# EAGLE design p1s-001 (EAGLE 9.6.2)
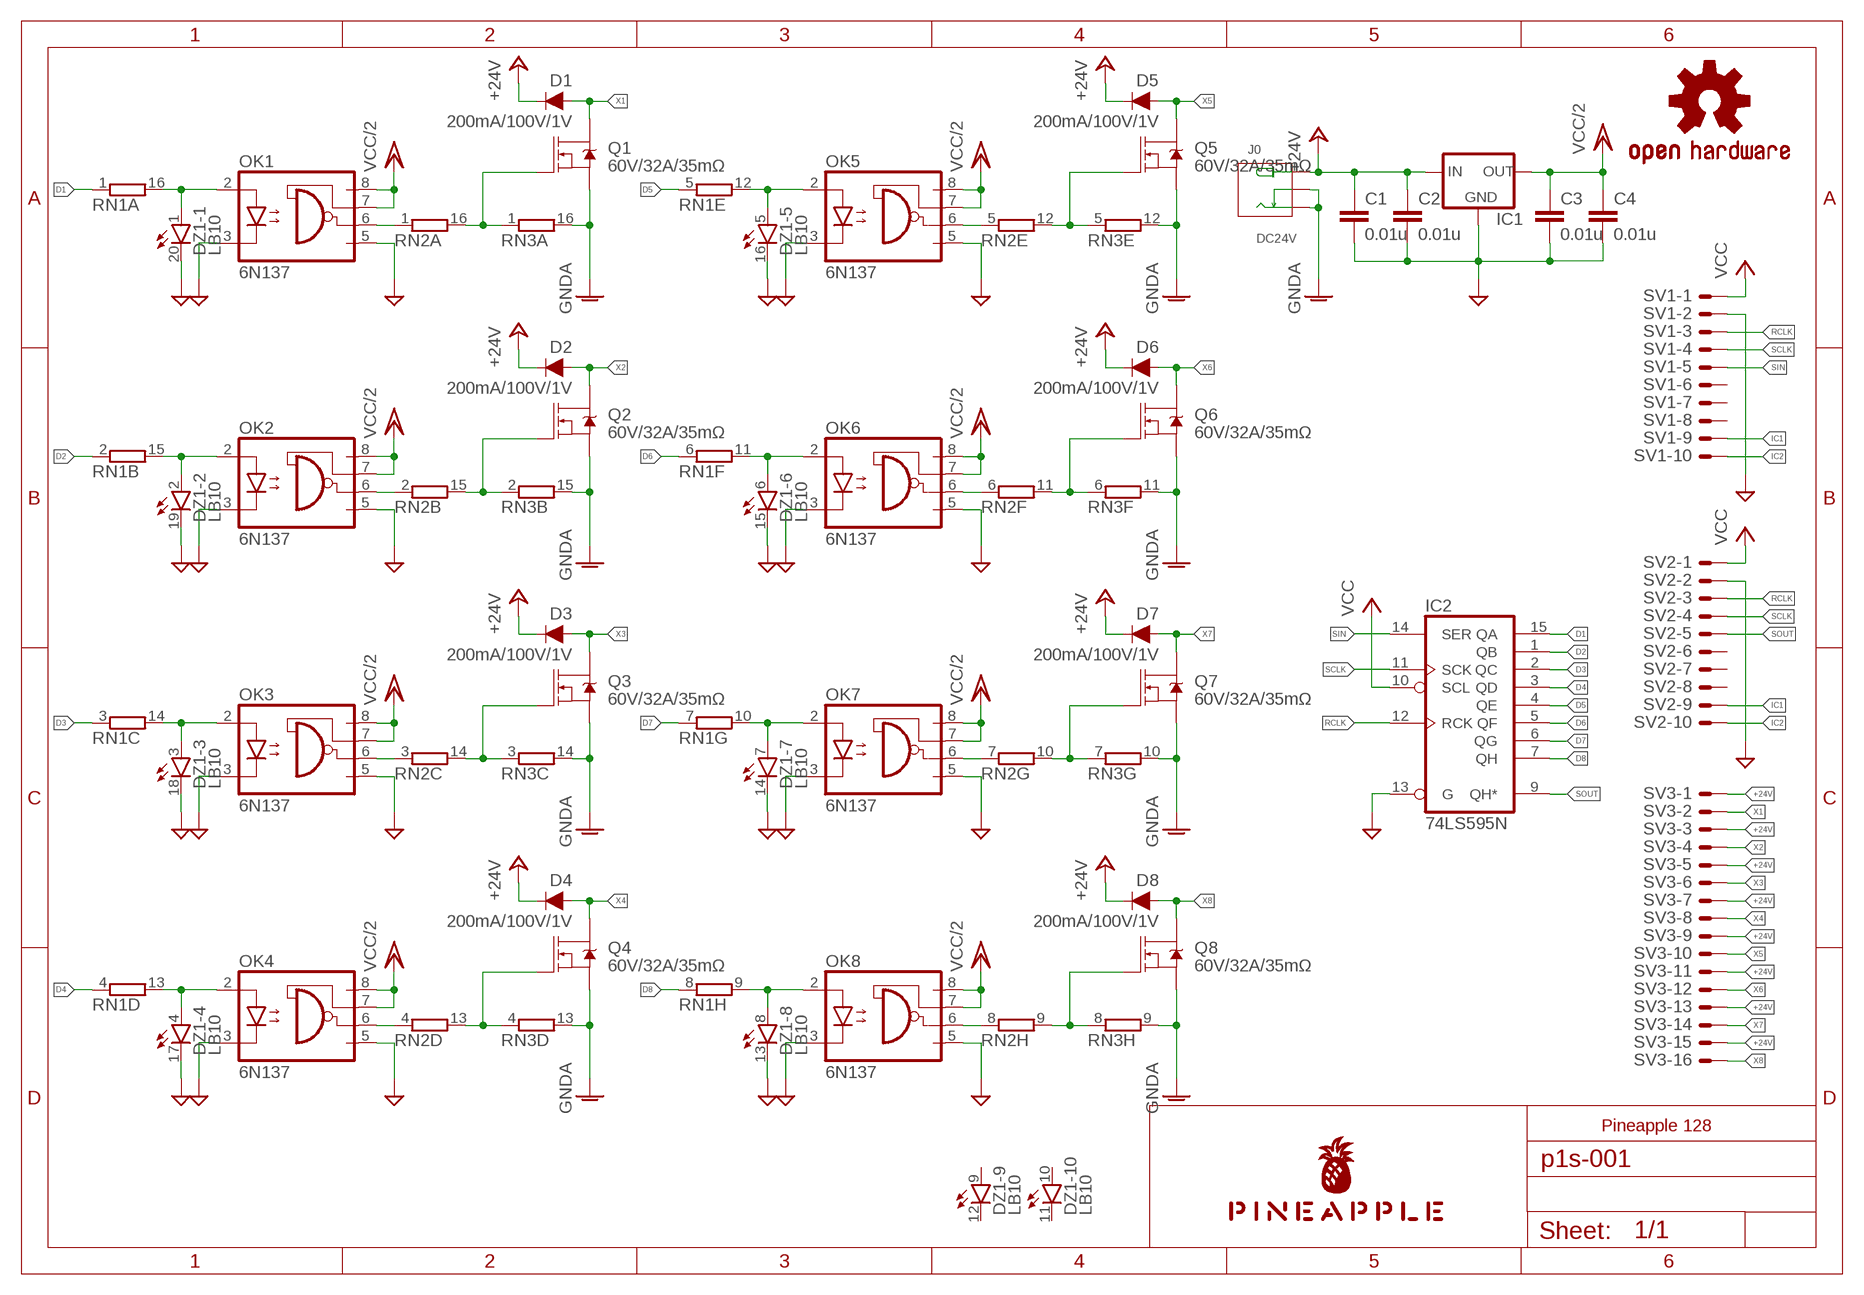
[diagram p0: schematic, sheet 1]

## Parts
C1  0.01u  C-EU025-024X044  [C025-024X044]
C2  0.01u  C-EU025-024X044  [C025-024X044]
C3  0.01u  C-EU025-024X044  [C025-024X044]
C4  0.01u  C-EU025-024X044  [C025-024X044]
D1  200mA/100V/1V  DIODE-1N4148  [DIODE-1N4148]
D2  200mA/100V/1V  DIODE-1N4148  [DIODE-1N4148]
D3  200mA/100V/1V  DIODE-1N4148  [DIODE-1N4148]
D4  200mA/100V/1V  DIODE-1N4148  [DIODE-1N4148]
D5  200mA/100V/1V  DIODE-1N4148  [DIODE-1N4148]
D6  200mA/100V/1V  DIODE-1N4148  [DIODE-1N4148]
D7  200mA/100V/1V  DIODE-1N4148  [DIODE-1N4148]
D8  200mA/100V/1V  DIODE-1N4148  [DIODE-1N4148]
DZ1  LB10  [LB10]
IC1  78XXS  [78XXS]
IC2  74LS595N  [DIL16]
J0  DC24V  JACK-DC-005'DC-005'  [3P-L14.2*W11.0*H9.0MM]
LOGO1  OSHW-LOGOS-COPPER  [OSHW-LOGO-S_COPPER]
OK1  6N137  [DIL08]
OK2  6N137  [DIL08]
OK3  6N137  [DIL08]
OK4  6N137  [DIL08]
OK5  6N137  [DIL08]
OK6  6N137  [DIL08]
OK7  6N137  [DIL08]
OK8  6N137  [DIL08]
Q1  60V/32A/35mΩ  MOSFET-NCH-FQP30N06L  [TO220V]
Q2  60V/32A/35mΩ  MOSFET-NCH-FQP30N06L  [TO220V]
Q3  60V/32A/35mΩ  MOSFET-NCH-FQP30N06L  [TO220V]
Q4  60V/32A/35mΩ  MOSFET-NCH-FQP30N06L  [TO220V]
Q5  60V/32A/35mΩ  MOSFET-NCH-FQP30N06L  [TO220V]
Q6  60V/32A/35mΩ  MOSFET-NCH-FQP30N06L  [TO220V]
Q7  60V/32A/35mΩ  MOSFET-NCH-FQP30N06L  [TO220V]
Q8  60V/32A/35mΩ  MOSFET-NCH-FQP30N06L  [TO220V]
RN1  8R-N  [DIL16]
RN2  8R-N  [DIL16]
RN3  8R-N  [DIL16]
SV1  ML10LE  [ML10L]
SV2  ML10LE  [ML10L]
SV3  ML16LE  [ML16L]
U$1  PINEAPPLE450_SILK  [PINEAPPLE450_SILK]

## Nets
+24V [power]: C1.1 C2.1 D1.C D2.C D3.C D4.C D5.C D6.C D7.C D8.C IC1.IN J0.+ SV3.1 SV3.3 SV3.5 SV3.7 SV3.9 SV3.11 SV3.13 SV3.15
D1: IC2.15(QA) RN1.1
D2: IC2.1(QB) RN1.2
D3: IC2.2(QC) RN1.3
D4: IC2.3(QD) RN1.4
D5: IC2.4(QE) RN1.5
D6: IC2.5(QF) RN1.6
D7: IC2.6(QG) RN1.7
D8: IC2.7(QH) RN1.8
GND [gnd]: C1.2 C2.2 C3.2 C4.2 DZ1.13(-8:C) DZ1.14(-7:C) DZ1.15(-6:C) DZ1.16(-5:C) DZ1.17(-4:C) DZ1.18(-3:C) DZ1.19(-2:C) DZ1.20(-1:C) IC1.GND IC2.13(G) OK1.3(C) OK1.5(GND) OK2.3(C) OK2.5(GND) OK3.3(C) OK3.5(GND) OK4.3(C) OK4.5(GND) OK5.3(C) OK5.5(GND) OK6.3(C) OK6.5(GND) OK7.3(C) OK7.5(GND) OK8.3(C) OK8.5(GND) SV1.2 SV2.2
GNDA [gnd]: J0.-1(-) J0.-2(CDN) Q1.3(S) Q2.3(S) Q3.3(S) Q4.3(S) Q5.3(S) Q6.3(S) Q7.3(S) Q8.3(S) RN3.9 RN3.10 RN3.11 RN3.12 RN3.13 RN3.14 RN3.15 RN3.16
IC1: SV1.9 SV2.9
IC2: SV1.10 SV2.10
N$1: DZ1.1(-1:A) OK1.2(A) RN1.16
N$2: OK1.6(VO) RN2.1
N$3: Q1.1(G) RN2.16 RN3.1
N$4: DZ1.2(-2:A) OK2.2(A) RN1.15
N$5: OK2.6(VO) RN2.2
N$6: Q2.1(G) RN2.15 RN3.2
N$7: DZ1.3(-3:A) OK3.2(A) RN1.14
N$8: OK3.6(VO) RN2.3
N$9: Q3.1(G) RN2.14 RN3.3
N$10: DZ1.4(-4:A) OK4.2(A) RN1.13
N$11: OK4.6(VO) RN2.4
N$12: Q4.1(G) RN2.13 RN3.4
N$13: DZ1.5(-5:A) OK5.2(A) RN1.12
N$14: OK5.6(VO) RN2.5
N$15: Q5.1(G) RN2.12 RN3.5
N$16: DZ1.6(-6:A) OK6.2(A) RN1.11
N$17: OK6.6(VO) RN2.6
N$18: Q6.1(G) RN2.11 RN3.6
N$19: DZ1.7(-7:A) OK7.2(A) RN1.10
N$20: OK7.6(VO) RN2.7
N$21: Q7.1(G) RN2.10 RN3.7
N$22: DZ1.8(-8:A) OK8.2(A) RN1.9
N$23: OK8.6(VO) RN2.8
N$24: Q8.1(G) RN2.9 RN3.8
RCLK: IC2.12(RCK) SV1.3 SV2.3
SCLK: IC2.11(SCK) SV1.4 SV2.4
SIN: IC2.14(SER) SV1.5
SOUT: IC2.9(QH*) SV2.5
VCC: IC2.10(SCL) SV1.1 SV2.1
VCC/2 [power]: C3.1 C4.1 IC1.OUT OK1.7(VE) OK1.8(VCC) OK2.7(VE) OK2.8(VCC) OK3.7(VE) OK3.8(VCC) OK4.7(VE) OK4.8(VCC) OK5.7(VE) OK5.8(VCC) OK6.7(VE) OK6.8(VCC) OK7.7(VE) OK7.8(VCC) OK8.7(VE) OK8.8(VCC)
X1: D1.A Q1.2(D) SV3.2
X2: D2.A Q2.2(D) SV3.4
X3: D3.A Q3.2(D) SV3.6
X4: D4.A Q4.2(D) SV3.8
X5: D5.A Q5.2(D) SV3.10
X6: D6.A Q6.2(D) SV3.12
X7: D7.A Q7.2(D) SV3.14
X8: D8.A Q8.2(D) SV3.16
Unconnected: DZ1.9(-9:A) DZ1.10(-10:A) DZ1.11(-10:C) DZ1.12(-9:C) SV1.6 SV1.7 SV1.8 SV2.6 SV2.7 SV2.8

## Notes on the sheet
- Pineapple 128

## Power pins joined to a net without a drawn wire
GND: IC2.8(GND)
VCC: IC2.16(VCC)

## Library data of the parts
C1-C4 = resistor:C-EU: CAPACITOR, European symbol
D1-D8 = SparkFun-DiscreteSemi:DIODE: Diode These are standard reverse protection diodes and small signal diodes. SparkFun Products: SparkFun SparkPunk Sound Kit <https://www.sparkfun.com/products/11177> SparkFun ESP8266 Thing <https://www.sparkfun.com/products/13231>; PROD_ID: DIO-08378
DZ1 = led:LB10: LED BLOCK 10-LED bar graph, DIL, Siemens
IC1 = v-reg:78XXS: VOLTAGE REGULATOR
IC2 = 74xx-us:74*595: 8-bit SHIFT REGISTER, output latch
J0 = Seeed-Connector:JACK-DC-005: 320120003
LOGO1 = SparkFun-Aesthetics:OSHW-LOGO: Open-Source Hardware (OSHW) Logo This logo indicates the piece of hardware it is found on incorporates a OSHW license and/or adheres to the definition of open source hardware found here: http://freedomdefined.org/OSHW
OK1-OK8 = optocoupler:6N137: MOTOROLA OPTO COUPLER; MPN: 6N137; OC_FARNELL: 1328376; OC_NEWARK: 52M1895
Q1-Q8 = SparkFun-DiscreteSemi:MOSFET-NCH: N-channel MOSFETs Voltage controlled devices that allow control of high current outputs. SparkFun Products: SparkFun OpenScale <https://www.sparkfun.com/products/13261> SparkFun Digital Sandbox <https://www.sparkfun.com/products/12651> SparkFun Monster Moto Shield <https://www.sparkfun.com/products/10182> SparkFun MOSFET Power Controller <https://www.sparkfun.com/products/11214>; PROD_ID: TRANS-10060
RN1-RN3 = resistor-dil:8R-N: DIL RESISTOR; OC_FARNELL: unknown; OC_NEWARK: unknown
SV1 SV2 = con-ml:ML10LE: HARTING; OC_FARNELL: unknown; OC_NEWARK: unknown
SV3 = con-ml:ML16LE: HARTING; OC_FARNELL: unknown; OC_NEWARK: unknown
U$1 = pineapple:PINEAPPLE450_SILK

## Net classes
0 default: width 0.152 mm, drill 0.152 mm, clearance 0.152 mm
1 gnd: width 0.305 mm, drill 0.152 mm, clearance 0.152 mm
2 power: width 0.305 mm, drill 0.152 mm, clearance 0.152 mm
3 analog: width 0.152 mm, drill 0.152 mm, clearance 0.152 mm

## Board
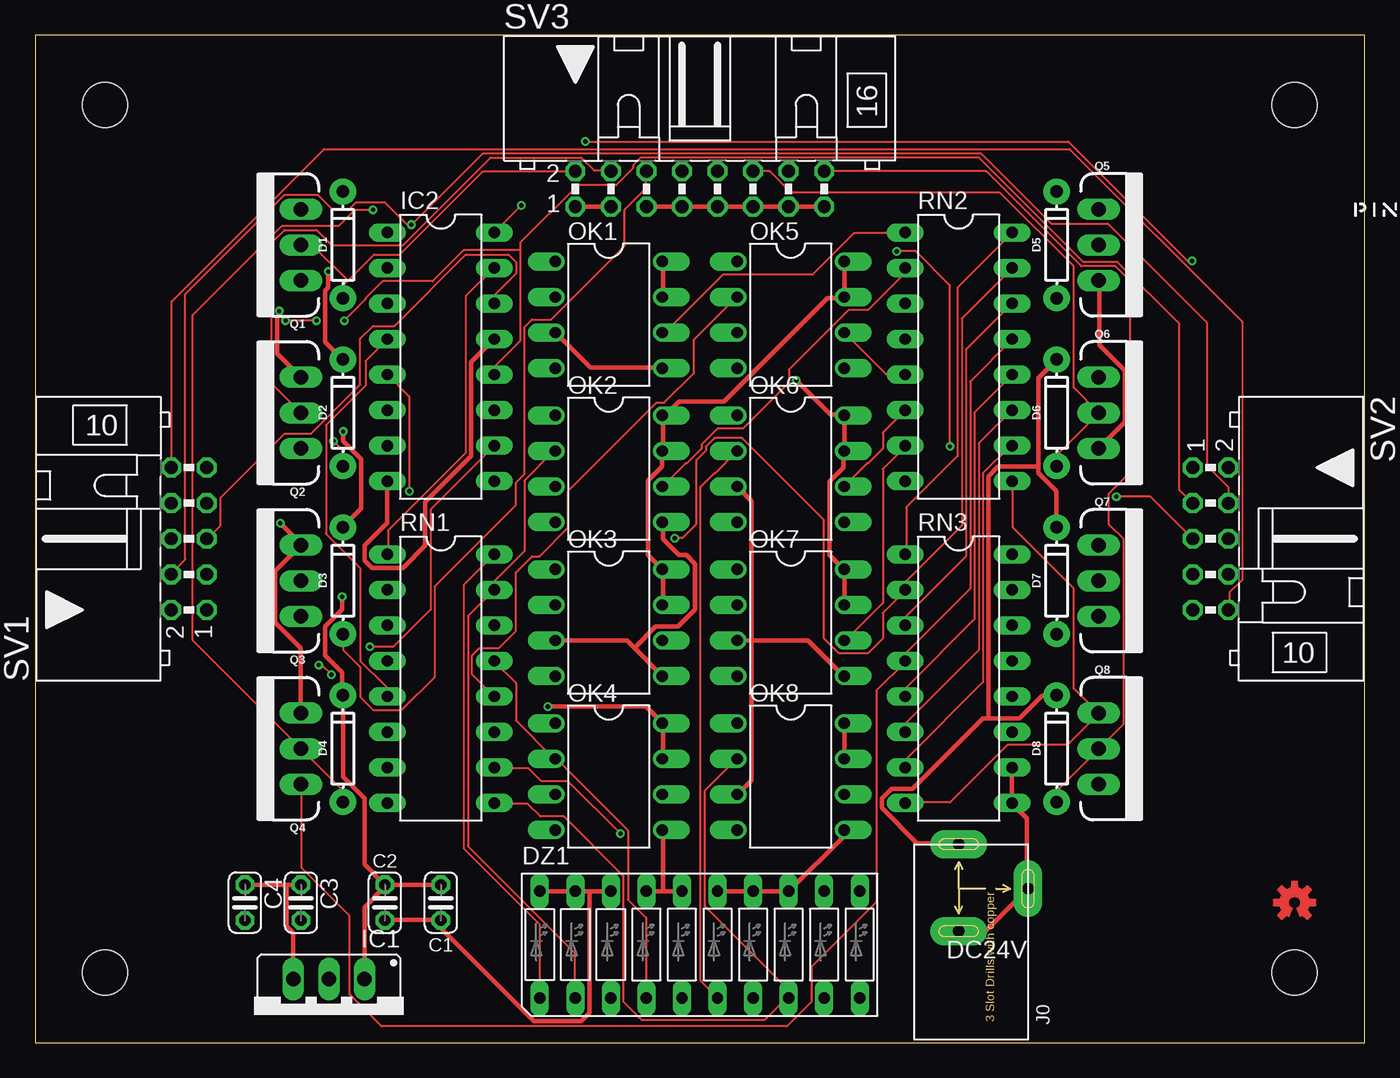
[diagram p1: board, top side]
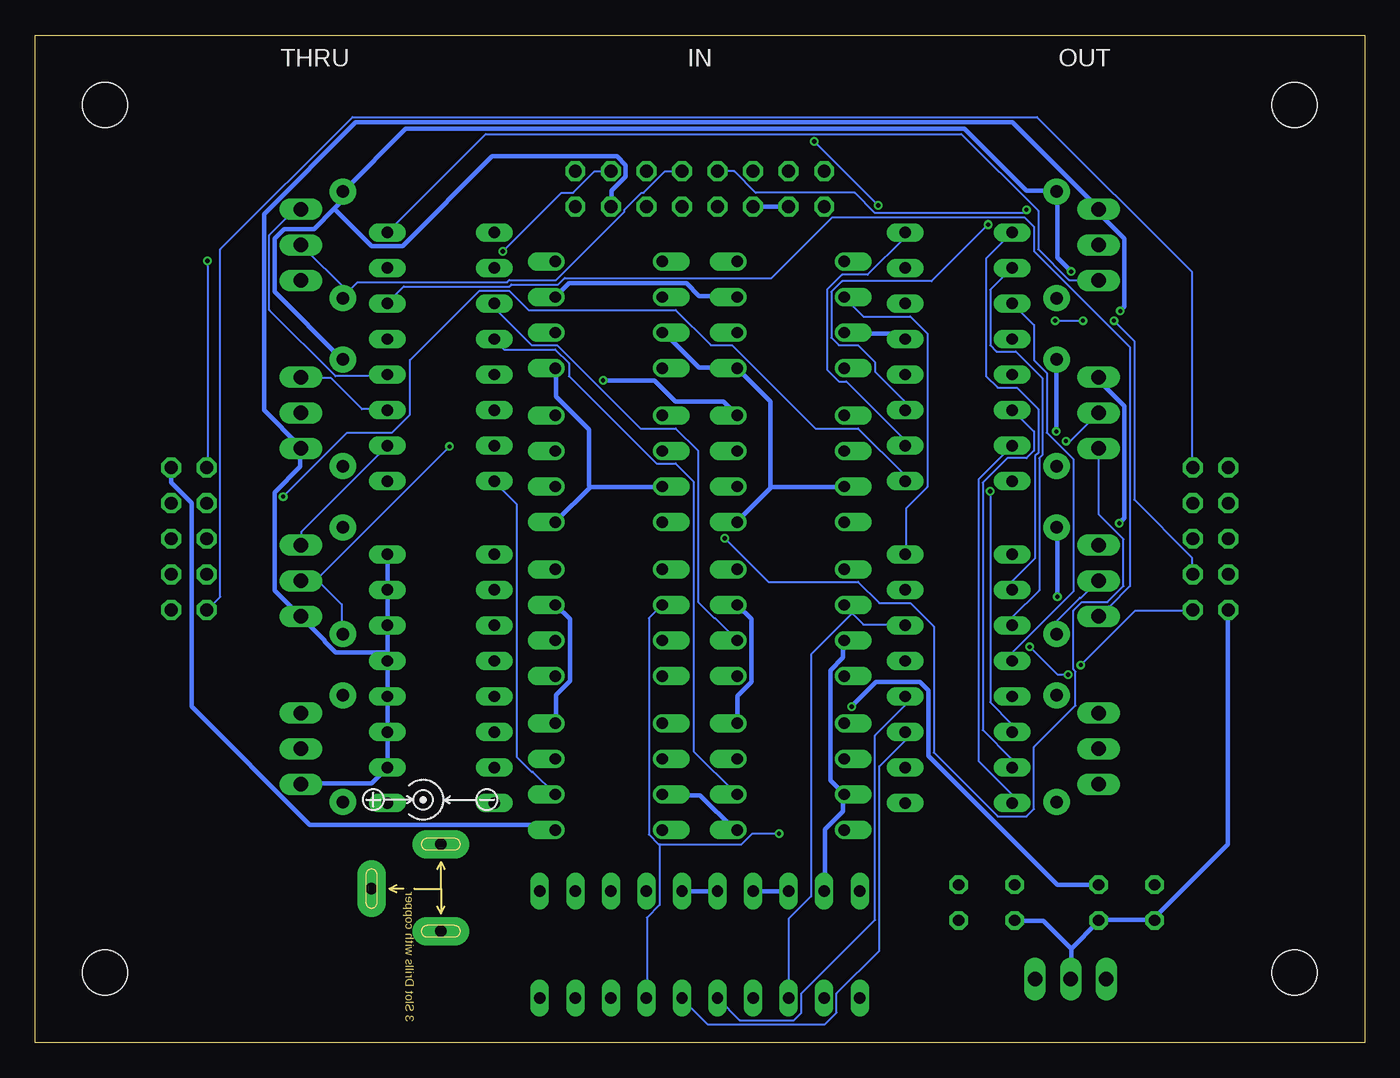
[diagram p2: board, bottom side, seen from below]

Size 95 x 72 mm. Coordinates in mm from the lower left corner, seen from the top.
Outline: 0,0 95,0 95,72 0,72 0,0
Copper layers (1*16): Top 0.035mm / dielectric 1.5mm / Bottom 0.035mm
Design rules "SeeedStudio_2layer_DRU_no_angle_20140221": minimum track width 6mil, minimum drill 12mil, track to track 6mil, track to pad 6mil, pad to pad 6mil, via to via 6mil, smd to smd 0mil, copper to edge 10mil, drill to drill 10mil, minimum pad ring 10mil, minimum via ring 6mil, stop-mask expansion 2mil, vias tented up to drill 100mil, thermal gap 10mil
Holes 3.2 mm at 5,5 90,5 90,67 5,67
tRestrict: area 2.8,64.8 to 7.2,69.2; area 87.8,64.8 to 92.2,69.2; area 2.8,2.8 to 7.2,7.2; area 87.8,2.8 to 92.2,7.2; area 0,71 to 95,72; area 94,0 to 95,72; area 0,0 to 95,1; area 0,0 to 1,72
bRestrict: area 2.8,2.8 to 7.2,7.2; area 87.8,2.8 to 92.2,7.2; area 87.8,64.8 to 92.2,69.2; area 2.8,64.8 to 7.2,69.2; area 0,71 to 95,72; area 94,0 to 95,72; area 0,0 to 95,1; area 0,0 to 1,72

### Footprints (pad centres in the part's own frame; a part is rotated, then mirrored left to right if it is on the bottom)
C025-024X044 = drill 0.813 octagon: 1 -1.27,0; 2 1.27,0
DIODE-1N4148 = drill 0.9 pad 1.88: A -3.81,0; C 3.81,0
LB10 = drill 0.813 long: 1 -11.43,-3.81; 2 -8.89,-3.81; 3 -6.35,-3.81; 4 -3.81,-3.81; 5 -1.27,-3.81; 6 1.27,-3.81; 7 3.81,-3.81; 8 6.35,-3.81; 9 8.89,-3.81; 10 11.43,-3.81; 11 11.43,3.81; 12 8.89,3.81; 13 6.35,3.81; 14 3.81,3.81; 15 1.27,3.81; 16 -1.27,3.81; 17 -3.81,3.81; 18 -6.35,3.81; 19 -8.89,3.81; 20 -11.43,3.81
78XXS = drill 1.016 long: GND 0,-2.54; IN -2.54,-2.54; OUT 2.54,-2.54
DIL16 = drill 0.813 long: 1 -8.89,-3.81; 2 -6.35,-3.81; 3 -3.81,-3.81; 4 -1.27,-3.81; 5 1.27,-3.81; 6 3.81,-3.81; 7 6.35,-3.81; 8 8.89,-3.81; 9 8.89,3.81; 10 6.35,3.81; 11 3.81,3.81; 12 1.27,3.81; 13 -1.27,3.81; 14 -3.81,3.81; 15 -6.35,3.81; 16 -8.89,3.81
3P-L14.2*W11.0*H9.0MM = drill 0.813 pad 2.032 long: + 3.175,0; -1 -3.048,0; -2 0,-4.953
DIL08 = drill 0.813 offset: 1 -3.81,-3.81; 2 -1.27,-3.81; 3 1.27,-3.81; 4 3.81,-3.81; 5 3.81,3.81; 6 1.27,3.81; 7 -1.27,3.81; 8 -3.81,3.81
TO220V = drill 1.016 long: 1 -2.54,0; 2 0,0; 3 2.54,0
ML10L = drill 0.914 octagon: 1 -5.08,-1.27; 2 -5.08,1.27; 3 -2.54,-1.27; 4 -2.54,1.27; 5 0,-1.27; 6 0,1.27; 7 2.54,-1.27; 8 2.54,1.27; 9 5.08,-1.27; 10 5.08,1.27
ML16L = drill 0.914 octagon: 1 -8.89,-1.27; 2 -8.89,1.27; 3 -6.35,-1.27; 4 -6.35,1.27; 5 -3.81,-1.27; 6 -3.81,1.27; 7 -1.27,-1.27; 8 -1.27,1.27; 9 1.27,-1.27; 10 1.27,1.27; 11 3.81,-1.27; 12 3.81,1.27; 13 6.35,-1.27; 14 6.35,1.27; 15 8.89,-1.27; 16 8.89,1.27

### Placement (x,y rotation side)
C1  29,10 270 top
C2  25,10 270 top
C3  19,10 270 top
C4  15,10 270 top
D1  22,57 90 top
D2  22,45 90 top
D3  22,33 90 top
D4  22,21 90 top
D5  73,57 90 top
D6  73,45 90 top
D7  73,33 90 top
D8  73,21 90 top
DZ1  47.5,7 0 top
IC1  21,2 180 top
IC2  29,49 270 top
J0  66,11 90 top
LOGO1  90,10 0 top
OK1  41,52 270 top
OK2  41,41 270 top
OK3  41,30 270 top
OK4  41,19 270 top
OK5  54,52 270 top
OK6  54,41 270 top
OK7  54,30 270 top
OK8  54,19 270 top
Q1  19,57 90 top
Q2  19,45 90 top
Q3  19,33 90 top
Q4  19,21 90 top
Q5  76,57 270 top
Q6  76,45 270 top
Q7  76,33 270 top
Q8  76,21 270 top
RN1  29,26 270 top
RN2  66,49 270 top
RN3  66,26 270 top
SV1  11,36 90 top
SV2  84,36 270 top
SV3  47.5,61 0 top
U$1  100,59 0 top  (outside the outline)

### Tracks (layer width: path | path; a pad name or v marks a point on that pad's centre or on a via)
+24V  (via drill 0.3)
  Top 0.305: C2.1 25.07,11.28 28.96,11.28 C1.1 | IC1.IN 23.55,4.57 23.55,9.68 24.99,11.12 C2.1 | C2.1 24.92,11.35 23.55,12.72 23.55,17.45 22.02,18.97 22.02,24.77 D4.C 21.95,24.92 21.95,26.44 20.73,27.66 20.73,29.72 21.95,30.94 v21.95,31.85 | v22.02,43.66 22.02,42.98 23.32,41.68 23.32,38.18 22.02,36.88 D3.C | v20.95,55.09 20.95,53.95 20.73,53.72 20.73,50.06 21.95,48.84 D2.C | 68.12,23.16 67.74,23.16 62.71,18.14 61.19,18.14 60.5,17.45 60.5,16.76 63.02,14.25 65.99,14.25 J0.+ | 68.12,23.16 70.33,23.16 71.93,24.77 73,24.77 D8.C | SV3.1 38.63,59.74 SV3.3 | SV3.5 43.74,59.74 46.18,59.74 SV3.7 46.33,59.74 SV3.9 48.92,59.74 51.28,59.74 SV3.11 51.44,59.74 53.8,59.74 SV3.13 53.95,59.74 SV3.15 | 71.7,41.15 71.7,47.47 73,48.77 D6.C | 71.7,41.15 71.7,40.69 73,39.4 73,36.88 D7.C | 68.12,23.16 68.12,40.46 68.81,41.15 71.7,41.15
  Bottom 0.305: v21.95,31.85 21.95,36.8 D3.C | v22.02,43.66 22.02,48.77 D2.C | v20.95,55.09 21.95,56.08 21.95,60.81 D1.C 22.1,60.88 24.16,60.88 28.57,65.3 68.5,65.3 72.92,60.88 D5.C 73.08,60.81 73.08,60.12 73.61,59.59 | SV3.3 41.22,59.74 43.66,59.74 SV3.5 | 73.61,59.59 75.06,58.14 77.19,58.14 77.88,57.45 77.88,53.65 73.08,48.84 D6.C | 73.61,59.59 70.94,56.92 68.73,56.92 62.33,63.32 53.42,63.32 52.81,62.71 52.81,61.87 53.8,60.88 53.8,59.74 SV3.13
D1
  Top 0.152: RN1.1 25.22,34.9 25.22,36.58 30.79,42.14 30.79,53.34 32.77,55.32 IC2.15
D2
  Bottom 0.152: RN1.2 25.15,32.38 25.15,32.99 23.55,34.59 23.55,41.91 23.32,42.14 23.32,45.26 24.84,46.79 26.21,46.79 27.05,47.62 27.05,56.01 25.22,57.84 IC2.1
D3
  Bottom 0.152: RN1.3 25.15,29.87 25.15,30.4 23.24,32.31 23.24,41.76 23.01,41.99 23.01,47.47 24.92,49.38 26.29,49.38 26.75,49.84 26.75,53.8 25.22,55.32 IC2.2
D4
  Bottom 0.152: RN1.4 25.15,27.28 25.15,27.89 20.8,32.23 20.8,41.68 22.71,43.59 22.71,47.85 23.62,48.77 23.62,51.28 25.15,52.81 IC2.3
D5
  Top 0.152: RN1.5 25.15,24.77 25.15,25.38 23.24,27.28 23.24,33.91 20.8,36.35 20.8,44.12 23.62,46.94 23.62,48.69 25.15,50.22 IC2.4
D6  (via drill 0.3)
  Top 0.152: v26.75,39.4 26.75,46.18 25.22,47.7 IC2.5
  Bottom 0.152: v26.75,39.4 26.75,24.31 25.22,22.78 25.22,22.25 RN1.6
D7
  Bottom 0.152: RN1.7 25.22,19.66 25.22,20.27 27.28,22.33 27.28,40.01 25.53,41.76 24.16,41.76 23.62,42.29 23.62,43.66 25.15,45.19 IC2.6
D8
  Bottom 0.152: RN1.8 25.22,17.14 25.22,17.75 27.58,20.12 27.58,40.23 25.22,42.6 IC2.7
GND
  Top 0.305: DZ1.15 48.84,10.82 51.28,10.82 DZ1.14 51.44,10.82 53.8,10.82 DZ1.13 53.95,10.9 57.76,14.71 57.76,15.16 OK8.5 | C2.2 25.07,8.76 28.96,8.76 C1.2 29.03,8.61 29.03,8.15 35.66,1.52 39.01,1.52 39.62,2.13 39.62,10.82 | IC2.8 25.15,40.08 25.15,37.11 23.55,35.51 23.55,34.44 24.08,33.91 26.29,33.91 27.89,35.51 27.89,38.63 31.17,41.91 31.17,48.62 32.77,50.22 IC2.13 | OK1.5 44.81,48.23 39.7,48.23 37.26,50.67 OK1.3 | 51.21,28.73 55.24,28.73 57.76,26.21 OK7.5 | 51.21,28.73 50.22,28.73 OK7.3 | 51.21,28.73 51.21,38.71 50.22,39.7 OK6.3 | 44.88,10.82 46.18,10.82 DZ1.16 | 44.88,10.82 43.74,10.82 DZ1.17 | 44.88,10.82 44.88,15.16 OK4.5 | 42.82,28.19 44.81,26.21 OK3.5 | 42.82,28.19 42.29,28.73 37.26,28.73 OK3.3 | DZ1.20 36.12,10.82 38.56,10.82 DZ1.19 38.71,10.82 39.62,10.82 | 39.62,10.82 DZ1.18 | 51.21,28.73 51.21,18.75 50.22,17.75 OK8.3 | 42.82,28.19 44.35,29.72 45.95,29.72 47.17,30.94 47.17,34.21 46.56,34.82 46.02,34.82 44.88,35.97 44.88,37.19 OK2.5
  Bottom 0.305: SV2.2 85.27,40.01 83.82,38.56 83.82,24 75.36,15.54 58.14,15.54 57.84,15.24 OK8.5 | SV1.2 9.75,30.86 9.75,14.17 15.01,8.91 C4.2 15.01,8.76 18.97,8.76 C3.2 19.05,8.61 20.95,6.71 | 20.95,6.71 20.95,4.57 IC1.GND | 20.95,6.71 22.94,8.69 24.99,8.69 C2.2 | 42.37,39.7 37.26,39.7 OK2.3 | 42.37,39.7 44.81,37.26 OK2.5 | OK5.3 50.14,50.67 49.99,50.67 47.55,48.23 44.88,48.23 OK1.5 44.73,48.08 42.44,45.8 42.44,39.78 42.37,39.7 | OK1.3 37.19,50.67 33.22,50.67 32.84,50.29 IC2.13 | 55.32,39.7 50.22,39.7 OK6.3 | 55.32,39.7 57.76,37.26 OK6.5 | OK5.5 57.76,48.16 57.76,46.18 55.4,43.81 55.4,39.78 55.32,39.7 | OK8.3 50.14,17.68 47.47,17.68 45.03,15.24 44.88,15.24 OK4.5 | DZ1.19 38.56,10.82 38.56,15.24 37.26,16.54 37.26,17.68 OK4.3 37.26,17.83 38.18,18.75 38.18,26.59 37.26,27.51 37.26,28.73 OK3.3 | DZ1.17 43.66,10.82 41.22,10.82 DZ1.18 | DZ1.15 46.25,10.82 DZ1.16
GNDA  (via drill 0.3)
  Top 0.305: Q4.3 18.97,23.55 18.97,28.19 17.14,30.02 17.14,33.68 18.97,35.51 Q3.3 18.97,35.66 v17.53,37.11 | v17.45,52.27 17.45,52.05 17.3,51.89 17.3,49.23 18.97,47.55 Q2.3 | J0.-1 66.06,8 67.97,8 70.94,10.97 J0.-2 70.87,11.12 70.87,16 69.88,16.99 RN3.9 69.8,17.14 69.8,19.58 RN3.10 | Q5.3 76.05,54.41 76.05,49.84 77.88,48.01 77.88,44.35 76.05,42.52 Q6.3
  Bottom 0.305: v17.53,37.11 17.14,37.49 17.14,45.49 18.97,47.32 18.97,47.47 Q2.3 | v17.45,52.27 17.14,52.58 17.14,57.45 18.97,59.28 18.97,59.51 Q1.3 19.05,59.66 25.15,65.76 72.08,65.76 78.64,59.21 78.64,45.19 76.05,42.6 Q6.3 76.05,42.44 76.05,41.15 77.88,39.32 77.88,32.31 76.12,30.56 Q7.3 75.97,30.4 74.3,28.73 74.3,28.65 73.53,27.89 69.88,27.89 RN3.13 | Q8.3 75.97,18.52 70.94,18.52 69.88,19.58 RN3.10 69.8,19.74 69.8,22.1 RN3.11 69.8,22.25 69.8,24.69 RN3.12 69.8,24.84 69.8,27.2 RN3.13 | RN3.13 69.8,27.36 69.8,29.79 RN3.14 69.8,29.95 69.8,32.31 RN3.15 69.8,32.46 69.8,34.82 RN3.16
IC1
  Bottom 0.152: SV1.9 12.34,41.15 12.34,55.09 23.39,66.14 72.31,66.14 81.76,56.69 81.76,31.85 82.68,30.94 SV2.9
IC2
  Top 0.152: SV2.10 85.34,30.94 85.34,32.16 86.26,33.07 86.26,51.51 73.91,63.86 20.65,63.86 9.75,52.96 9.75,41.15 SV1.10
N$1
  Top 0.152: DZ1.1 36.04,3.2 36.04,8.46 30.63,13.87 30.63,32.69 32.77,34.82 RN1.16
  Bottom 0.152: RN1.16 32.77,34.9 32.77,38.18 31.24,39.7 31.24,50.67 32.46,51.89 35.81,51.89 OK1.2
N$2
  Top 0.152: OK1.6 44.88,50.75 45.03,50.75 49.15,54.86 55.55,54.86 58.52,57.84 62.18,57.84 RN2.1
N$3
  Top 0.152: RN3.1 62.26,34.9 62.26,38.25 65.91,41.91 65.91,53.95 69.8,57.84 RN2.16
  Bottom 0.152: Q1.1 19.05,54.48 21.11,54.48 23.32,56.69 23.32,59.44 28.8,64.92 62.79,64.92 69.8,57.91 RN2.16
N$4
  Top 0.152: OK2.2 37.19,42.22 37.03,42.22 34.98,40.16 34.98,35.13 32.84,32.99 32.84,32.38 RN1.15 32.77,32.31 30.94,30.48 30.94,14.02 38.56,6.4 38.56,3.2 DZ1.2
N$5
  Top 0.152: OK2.6 44.88,39.78 46.48,41.38 46.56,41.38 47.62,42.44 47.62,42.75 48.77,43.89 50.6,43.89 53.87,47.17 53.87,48.08 58.14,52.35 59.51,52.35 62.18,55.02 62.18,55.32 RN2.2
N$6  (via drill 0.3)
  Top 0.152: RN2.15 69.8,55.32 66.22,51.74 66.22,36.96 62.26,32.99 62.26,32.38 RN3.2 62.18,32.31 60.58,30.71 60.58,28.88 59.51,27.81 57.45,27.81 56.39,28.88 56.39,37.34 50.52,43.2 48.54,43.2 47.93,42.6 47.93,42.29 47.24,41.6 47.24,37.03 46.25,36.04 v45.72,36.04
  Bottom 0.152: v45.72,36.04 42.6,32.92 36.2,32.92 34.67,31.39 32.46,31.39 30.79,29.72 30.79,20.73 26.21,16.15 24.16,16.15 23.62,16.69 23.62,21.11 20.65,24.08 20.65,26.52 20.8,26.67 20.8,30.86 20.19,31.47 18.36,31.47 17.22,32.61 17.22,35.97 18.97,37.72 18.97,42.44 Q2.1
N$7
  Bottom 0.152: RN1.14 32.84,29.87 35.81,29.87 37.19,31.24 OK3.2 36.65,30.63 39.55,27.74 39.55,10.44 41.15,8.84 DZ1.3
N$8
  Bottom 0.152: OK3.6 44.88,28.8 46.41,30.33 46.48,30.33 47.62,31.47 47.62,42.29 49.23,43.89 51.74,43.89 57.68,49.84 59.51,49.84 62.18,52.5 RN2.3
N$9
  Top 0.152: RN3.3 62.26,29.87 62.26,30.48 66.52,34.75 66.52,49.53 RN2.14
  Bottom 0.152: Q3.1 18.97,30.48 18.29,31.17 18.21,31.17 16.76,32.61 16.76,49.68 23.62,56.54 23.62,58.29 24.31,58.98 38.02,58.98 42.37,54.63 57.15,54.63 57.61,54.18 60.96,54.18 61.11,54.03 68.66,54.03 69.8,52.88 RN2.14
N$10
  Top 0.152: RN1.13 32.84,27.2 34.37,25.68 34.37,23.01 37.03,20.34 37.19,20.34 OK4.2 37.26,20.27 42.37,15.16 42.37,10.21 43.66,8.91 43.66,3.2 DZ1.4
N$11
  Bottom 0.152: OK4.6 44.88,17.75 47.93,20.8 47.93,40.08 49.23,41.38 50.6,41.38 56.84,47.62 56.84,48.54 57.84,49.53 61.49,49.53 62.18,50.22 RN2.4
N$12
  Top 0.152: RN2.13 69.8,50.22 66.83,47.24 66.83,32.46 62.26,27.89 62.26,27.28 RN3.4 62.18,27.2 60.12,25.15 60.12,10.06 55.47,5.41 55.47,2.9 53.72,1.14 24.77,1.14 22.48,3.43 22.48,9.07 19.05,12.5 19.05,18.44 Q4.1
N$13
  Top 0.152: OK5.2 50.14,53.26 47.09,50.22 47.09,47.85 44.96,45.72 44.42,45.72 38.1,39.4 38.1,36.8 36.04,34.75 35.51,34.75 34.37,33.6 34.37,29.41 33.15,28.19 31.77,28.19 31.24,27.66 31.24,26.29 32.77,24.77 RN1.12
  Bottom 0.152: RN1.12 32.84,24.69 32.84,24.08 34.98,21.95 34.98,8.76 40.23,3.5 40.23,2.13 40.77,1.6 44.65,1.6 46.18,3.12 DZ1.5
N$14
  Top 0.152: RN2.5 62.18,47.78 60.81,47.78 57.84,50.75 OK5.6
N$15
  Top 0.152: RN3.5 62.26,24.77 62.26,25.38 67.13,30.25 67.13,45.03 69.8,47.7 RN2.12
  Bottom 0.152: Q5.1 76.05,59.51 76.43,59.51 78.26,57.68 78.26,52.35 73.53,47.62 69.95,47.62 69.88,47.7 RN2.12
N$16
  Top 0.152: OK6.2 50.14,42.22 48.62,40.69 48.54,40.69 47.55,39.7 47.55,4.42 DZ1.6
  Bottom 0.152: RN1.11 32.84,22.17 32.84,21.57 34.67,19.74 34.67,6.55 37.72,3.5 37.72,2.13 38.56,1.29 46.94,1.29 48.77,3.12 DZ1.6
N$17
  Top 0.152: OK6.6 57.84,39.78 59.44,41.38 59.51,41.38 60.58,42.44 60.58,43.59 RN2.6
N$18
  Top 0.152: RN3.6 62.26,22.25 62.26,22.86 67.44,28.04 67.44,42.82 RN2.11
  Bottom 0.152: Q6.1 75.97,47.47 73.84,47.47 71.63,45.26 69.88,45.26 RN2.11
N$19  (via drill 0.3)
  Top 0.152: v41.83,14.94 38.1,18.67 36.2,18.67 35.28,19.58 32.84,19.58 RN1.10
  Bottom 0.152: 50.41,14.13 51.13,14.86 51.13,30.33 50.22,31.24 OK7.2 | 50.41,14.13 50.37,14.1 50.37,9.83 51.28,8.91 51.28,3.2 DZ1.7 | v41.83,14.94 43.74,14.94 44.5,14.17 50.37,14.17 50.41,14.13
N$20
  Top 0.152: OK7.6 57.84,28.8 57.99,28.8 60.58,31.39 60.58,41 62.18,42.6 RN2.7
N$21
  Top 0.152: RN3.7 62.26,19.66 62.26,20.27 67.74,25.76 67.74,40.69 69.65,42.6 69.8,42.6 RN2.10
  Bottom 0.152: Q7.1 75.97,35.59 75.97,36.5 69.88,42.6 RN2.10
N$22
  Top 0.152: OK8.2 50.14,20.27 47.85,17.98 47.85,9.75 53.8,3.81 53.8,3.2 DZ1.8 53.72,3.2 52.12,1.6 43.36,1.6 42.06,2.9 42.06,11.89 37.8,16.15 36.12,16.15 35.2,17.07 32.84,17.07 RN1.9
N$23
  Bottom 0.152: OK8.6 57.84,17.75 59.44,19.36 59.51,19.36 60.58,20.42 60.58,38.48 62.18,40.08 RN2.8
N$24
  Top 0.152: RN3.8 62.26,17.14 65.38,17.14 69.49,21.26 73.76,21.26 75.97,23.47 Q8.1 75.97,23.55 74.22,25.3 74.22,32.46 69.88,36.8 69.88,40.08 RN2.9
RCLK  (via drill 0.3)
  Top 0.152: 34.67,56.62 34.67,57.15 38.79,61.27 41.53,61.27 42.75,62.48 42.75,62.71 43.28,63.25 67.44,63.25 74.91,55.78 77.34,55.78 81.76,51.36 81.76,39.47 82.68,38.56 SV2.3 | 34.67,56.62 34.67,50.14 32.84,48.31 32.84,47.78 IC2.12 | v20.12,51.59 v17.91,51.59 | v22.1,51.59 23.62,53.11 23.62,53.19 24.84,54.41 28.42,54.41 30.63,56.62 34.67,56.62
  Bottom 0.152: v17.91,51.59 16.46,50.14 16.46,38.79 12.34,34.67 12.34,33.53 SV1.3 | v22.1,51.59 v20.12,51.59
SCLK  (via drill 0.3)
  Top 0.152: SV1.4 9.75,33.53 10.74,34.52 10.74,53.49 17.83,60.58 20.19,60.58 21.18,59.59 22.48,59.59 22.94,60.05 24.99,60.05 26.59,58.45 v26.9,58.45 32,63.55 67.59,63.55 72.62,58.52 76.66,58.52 83.74,51.44 83.74,41.22 85.27,39.7 85.27,38.56 SV2.4
  Bottom 0.152: v26.9,58.45 30.94,54.41 37.34,54.41 38.1,53.65 38.1,50.37 37.57,49.84 36.2,49.84 34.98,48.62 34.98,47.93 32.84,45.8 32.84,45.26 IC2.11
SIN
  Top 0.152: IC2.14 32.84,52.88 32.84,53.42 34.37,54.94 34.37,55.78 33.83,56.31 30.79,56.31 25.68,51.21 24.16,51.21 23.24,50.29 23.24,47.02 19.74,43.51 17.83,43.51 13.26,38.94 13.26,36.96 12.34,36.04 SV1.5
SOUT  (via drill 0.3)
  Top 0.152: v77.27,39.01 79.7,39.01 82.68,36.04 SV2.5
  Bottom 0.152: v77.27,39.01 72.69,43.59 69.49,43.59 68.2,44.88 68.2,48.77 63.25,53.72 61.11,53.72 59.74,52.35 49.23,52.35 46.71,49.84 45.19,49.84 39.24,43.89 36.2,43.89 32.84,40.54 32.84,40.16 IC2.9
VCC  (via drill 0.3)
  Top 0.152: v20.27,26.98 20.5,26.98 v21.18,26.29 | v23.93,28.27 25.6,28.27 28.27,30.94 28.27,38.1 32.77,42.6 IC2.10 | v82.68,55.85 82.37,55.85 73.84,64.39 v39.32,64.39 | v34.75,59.82 32.84,57.91 IC2.16
  Bottom 0.152: IC2.10 32.84,42.67 32.84,43.05 37.03,47.24 37.57,47.24 38.41,48.08 38.41,53.8 37.34,54.86 35.51,54.86 32.84,57.53 32.84,57.84 IC2.16 | v20.27,26.98 16.38,30.86 12.34,30.86 SV1.1 | v21.18,26.29 21.95,26.29 v23.93,28.27 | v82.68,55.85 82.68,41.15 SV2.1 | v34.75,59.82 v39.32,64.39
VCC/2  (via drill 0.3)
  Top 0.305: OK8.7 57.84,20.34 57.84,22.78 OK8.8 | OK7.7 57.84,31.32 57.84,33.76 OK7.8 57.68,33.91 56.77,34.82 56.77,40.08 57.76,41.07 57.76,42.14 OK6.7 57.84,42.29 57.84,44.81 OK6.8 57.68,44.88 56.84,44.88 v54.41,47.32 | OK1.7 44.88,53.34 44.88,55.78 OK1.8 | OK5.8 57.84,55.78 57.84,53.34 OK5.7 57.68,53.19 56.62,53.19 49.23,45.8 46.02,45.8 45.03,44.81 OK2.8 44.88,44.81 44.88,42.29 OK2.7 44.81,42.14 44.81,41.15 43.81,40.16 43.81,34.82 44.73,33.91 OK3.8 44.88,33.76 44.88,31.32 OK3.7 | 17.98,11.28 18.97,11.28 C3.1 | 17.98,11.28 C4.1 | 17.98,11.28 17.98,8.31 18.44,7.85 18.44,4.57 IC1.OUT | OK4.7 44.88,20.34 44.88,22.78 OK4.8 44.73,22.94 43.66,24 v36.65,24
  Bottom 0.305: OK8.8 57.76,22.86 57.76,24.84 56.77,25.83 56.77,30.25 57.76,31.24 OK7.7 | OK1.7 44.88,53.34 47.55,53.34 48.46,54.25 56.84,54.25 57.76,53.34 OK5.7 | OK4.8 44.81,22.86 44.81,24.77 43.81,25.76 43.81,30.25 44.81,31.24 OK3.7 | v36.65,24 34.9,25.76 31.77,25.76 31.17,25.15 31.17,20.5 21.95,11.28 19.05,11.28 C3.1 | v54.41,47.32 50.75,47.32 49.23,45.8 45.8,45.8 OK2.8
X1
  Top 0.152: 22.36,54.45 22.02,54.1 22.02,53.26 D1.A | 22.36,54.45 24.23,56.31 26.06,56.31 32,62.26 38.56,62.26 SV3.2 | 22.36,54.45 19.81,57 19.05,57 Q1.2
X2  (via drill 0.3)
  Top 0.152: SV3.4 41.15,62.33 39.93,62.33 39.01,63.25 32.54,63.25 26.29,57 21.18,57 20.12,58.06 17.83,58.06 16.92,57.15 16.92,47.09 18.97,45.03 Q2.2 | v21.34,42.98 21.95,42.37 21.95,41.22 D2.A
  Bottom 0.152: v21.34,42.98 21.03,42.98 19.05,44.96 Q2.2
X3
  Top 0.152: SV3.6 43.66,62.26 43.66,61.04 42.14,59.51 42.14,56.92 36.88,51.66 35.51,51.66 34.98,51.13 34.98,40.62 34.37,40.01 34.37,38.41 28.57,32.61 28.57,26.14 26.21,23.77 24.16,23.77 23.24,24.69 23.24,26.82 22.02,28.04 22.02,29.18 D3.A
  Bottom 0.152: Q3.2 19.05,32.99 20.27,31.77 20.34,31.77 21.95,30.18 21.95,29.26 D3.A
X4  (via drill 0.3)
  Top 0.152: v24.16,59.51 22.86,59.51 21.72,58.37 17.68,58.37 11.28,51.97 11.28,28.73 18.97,21.03 Q4.2 19.05,20.95 21.95,18.06 21.95,17.22 D4.A
  Bottom 0.152: v24.16,59.51 24.38,59.28 34.98,59.28 36.42,60.73 43.51,60.73 45.03,62.26 46.18,62.26 SV3.8
X5
  Bottom 0.152: 72.62,53.65 73,53.26 D5.A 72.62,53.65 | 72.62,53.65 71.93,54.33 61.27,54.33 61.11,54.48 57.76,54.48 52.88,59.36 52.88,59.51 51.66,60.73 51.51,60.73 49.99,62.26 48.84,62.26 SV3.10 | 72.62,53.65 75.97,57 Q5.2
X6
  Top 0.152: SV3.12 51.36,62.26 52.5,62.26 54.03,60.73 68.96,60.73 74.22,55.47 74.22,46.79 75.97,45.03 Q6.2 75.97,44.96 73.08,42.06 73.08,41.22 D6.A
X7  (via drill 0.3)
  Top 0.152: v61.57,56.54 62.94,56.54 65.38,54.1 v65.38,42.6
  Bottom 0.152: v61.57,56.54 57.38,60.73 56.54,60.73 55.02,62.26 53.87,62.26 SV3.14 | v65.38,42.6 74.91,33.07 75.97,33.07 Q7.2 74.83,33.07 73.08,31.32 73.08,29.26 D7.A
X8
  Top 0.152: SV3.16 56.46,62.26 67.97,62.26 74.75,55.47 77.19,55.47 78.26,54.41 78.26,40.77 76.73,39.24 76.73,37.03 77.8,35.97 77.8,22.78 76.05,21.03 Q8.2 75.97,20.95 73.08,18.06 73.08,17.22 D8.A

### Text on the board
tNames: Cat-8 1.0.0-X | DC24V
bNames: OUT | IN | THRU